# Altium schematic sheet Peripheral.SchDoc
size A4; SheetNumber: 3; SheetTotal: 4
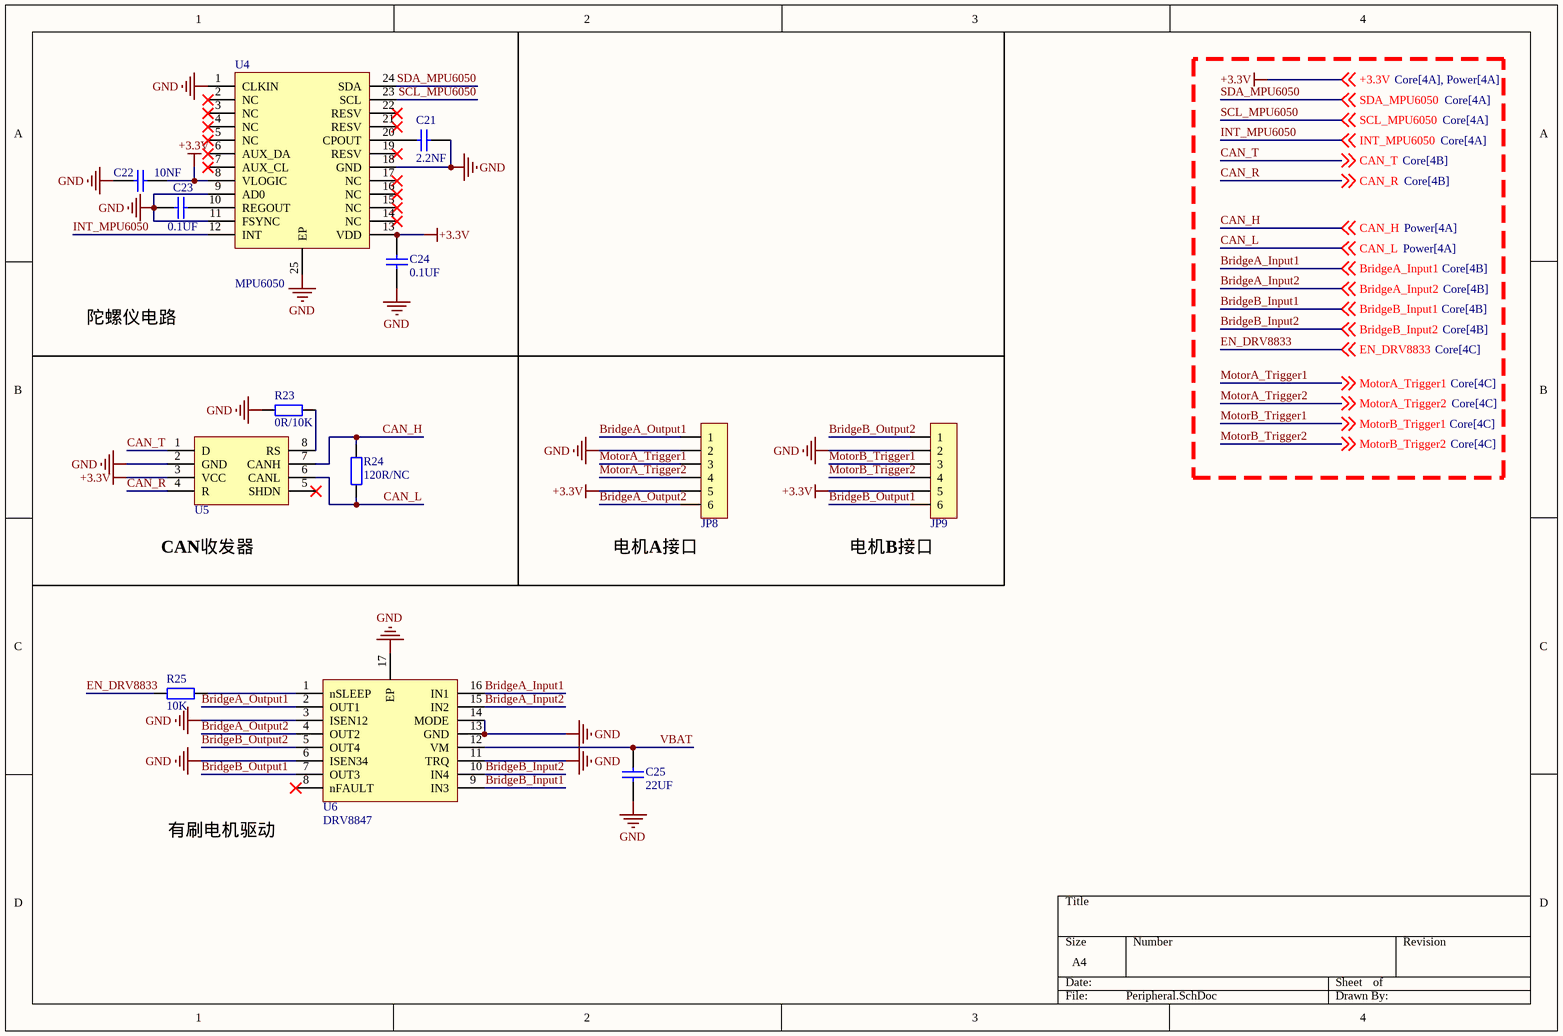
[diagram p0: Peripheral.SchDoc]

## Parts
C21  2.2NF  [C0402_NS]
C22  10NF  [C0402_NS]
C23  0.1UF  [C0402_NS]
C24  0.1UF  [C0402_NS]
C25  22UF  [C0805_NS]
JP8  HDR-1X6  [XH2.54-WI-6P]  (value not drawn)
JP9  HDR-1X6  [XH2.54-WI-6P]  (value not drawn)
R23  0R/10K  [R0402_NS]
R24  120R/NC  [R0402_NS]
R25  10K  [R0402_NS]
U4  MPU6050  [QFN24_L4.0_W4.0_P0.5]
U5  SIT3051  [DFN8_L3.0_W3.0_P0.65]  (value not drawn)
U6  DRV8847  [ETSSOP16_L5.0_W4.4_P0.65]

## Nets
+3.3V: C22.1 C24.2 JP8.5 JP9.5 U4.8(VLOGIC) U4.13(VDD) U5.3(VCC) ; off-sheet +3.3V
GND: C21.2 C22.2 C23.2 C24.1 C25.1 JP8.2 JP9.2 R23.2 U4.1(CLKIN) U4.9(AD0) U4.11(FSYNC) U4.18(GND) U4.25(EP) U5.2(GND) U6.3(ISEN12) U6.6(ISEN34) U6.11(TRQ) U6.13(GND) U6.14(MODE) U6.17(EP)
BridgeA_Input1: U6.16(IN1) ; off-sheet BridgeA_Input1
BridgeA_Input2: U6.15(IN2) ; off-sheet BridgeA_Input2
BridgeA_Output1: JP8.1 U6.2(OUT1)
BridgeA_Output2: JP8.6 U6.4(OUT2)
BridgeB_Input1: U6.9(IN3) ; off-sheet BridgeB_Input1
BridgeB_Input2: U6.10(IN4) ; off-sheet BridgeB_Input2
BridgeB_Output1: JP9.6 U6.7(OUT3)
BridgeB_Output2: JP9.1 U6.5(OUT4)
CAN_H: R24.2 U5.7(CANH) ; off-sheet CAN_H
CAN_L: R24.1 U5.6(CANL) ; off-sheet CAN_L
CAN_R: U5.4(R) ; off-sheet CAN_R
CAN_T: U5.1(D) ; off-sheet CAN_T
EN_DRV8833: R25.1 ; off-sheet EN_DRV8833
INT_MPU6050: U4.12(INT) ; off-sheet INT_MPU6050
MotorA_Trigger1: JP8.3 ; off-sheet MotorA_Trigger1
MotorA_Trigger2: JP8.4 ; off-sheet MotorA_Trigger2
MotorB_Trigger1: JP9.3 ; off-sheet MotorB_Trigger1
MotorB_Trigger2: JP9.4 ; off-sheet MotorB_Trigger2
SCL_MPU6050: U4.23(SCL) ; off-sheet SCL_MPU6050
SDA_MPU6050: U4.24(SDA) ; off-sheet SDA_MPU6050
VBAT: C25.2 U6.12(VM)
NetC21_1: C21.1 U4.20(CPOUT)
NetC23_1: C23.1 U4.10(REGOUT)
NetR23_1: R23.1 U5.8(RS)
NetR25_2: R25.2 U6.1(nSLEEP)

Not connected (* = marked no-connect by the designer): U4 2(NC)* 3(NC)* 4(NC)* 5(NC)* 6(AUX_DA)* 7(AUX_CL)* 14(NC)* 15(NC)* 16(NC)* 17(NC)* 19(RESV)* 21(RESV)* 22(RESV)*; U5 5(SHDN)*; U6 8(nFAULT)*

## Notes on the sheet
- 陀螺仪电路
- (near U5) CAN收发器
- 电机A接口
- (near JP9) 电机B接口
- 有刷电机驱动

## Library data of the parts
C21-C25 = C: 贴片电容/MLCC电容; BOM名称: MLCC
JP8 JP9 = Header 6: 6P接插件; BOM名称: 6P接插件
R23-R25 = R: 贴片电阻; BOM名称: 贴片电阻
U5 = SIT3051: CAN收发芯片; Manufacturer: Texas Instruments; Protocol: CAN; Number of Drivers/Receivers: 1/1; Duplex: Half; Data Rate: 1Mbps; Voltage - Supply: 3 V ~ 3.6 V; Supplier 1: Digi-Key; Supplier Part Number 1: 296-26344-2-ND; RoHS: RoHS Compliant; Category: Integrated Circuits (ICs); Stock: 5000; Pricing 1: 2500=0.84375 (USD); Packaging: Tape & Reel (TR); Part Status: Active; Type: Transceiver; Operating Temperature: -40°C ~ 85°C; Mounting Type: Surface Mount; Package / Case: 8-SOIC (0.154", 3.90mm Width); Supplier Device Package: 8-SOIC; ComponentLink1URL: http://www.ti.com/lit/ds/symlink/sn65hvd230.pdf; ComponentLink1Description: http://www.ti.com/lit/ds/symlink/sn65hvd230.pdf; Supplier 2: Digi-Key; Supplier Part Number 2: 296-26344-1-ND; Pricing 2: 1=2.05, 10=1.842, 100=1.4809, 500=1.21668, 1000=1.00811 (USD)
U6 = DRV8847: 具有电流调节和独立半桥控制的 18V、2A 双路 H 桥电机驱动器